# EAGLE design v003 (EAGLE 6.4)
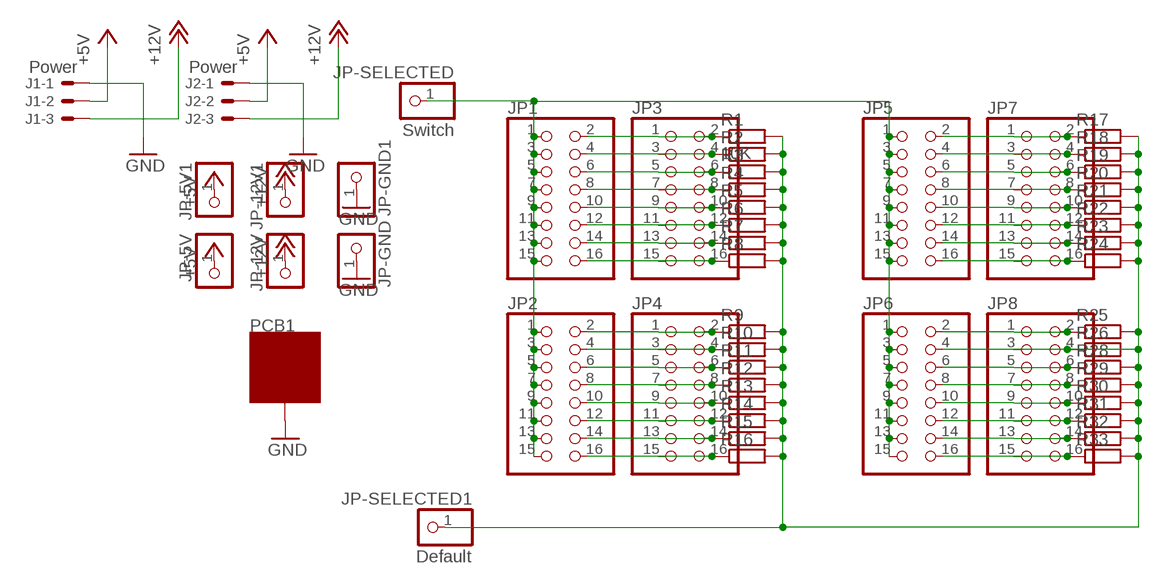
[diagram p0: schematic, sheet 1]

## Parts
J1  Power  22-27-2031-03  [6410-03]
J2  Power  22-27-2031-03  [6410-03]
JP1  PINHD-2X8  [2X08]
JP2  PINHD-2X8  [2X08]
JP3  PINHD-2X8  [2X08]
JP4  PINHD-2X8  [2X08]
JP5  PINHD-2X8  [2X08]
JP6  PINHD-2X8  [2X08]
JP7  PINHD-2X8  [2X08]
JP8  PINHD-2X8  [2X08]
JP-5V  PINHD-1X1  [1X01]
JP-5V1  PINHD-1X1  [1X01]
JP-12V  PINHD-1X1  [1X01]
JP-12V1  PINHD-1X1  [1X01]
JP-GND  PINHD-1X1  [1X01]
JP-GND1  PINHD-1X1  [1X01]
JP-SELECTED  Switch  PINHD-1X1  [1X01]
JP-SELECTED1  Default  PINHD-1X1  [1X01]
PCB1  ZZZ_MODULE05X05  [ZZZ_MODULE_05X05]
R1  10K  R-EU_0207/2V  [0207/2V]
R2  R-EU_0207/2V  [0207/2V]
R3  R-EU_0207/2V  [0207/2V]
R4  R-EU_0207/2V  [0207/2V]
R5  R-EU_0207/2V  [0207/2V]
R6  R-EU_0207/2V  [0207/2V]
R7  R-EU_0207/2V  [0207/2V]
R8  R-EU_0207/2V  [0207/2V]
R9  R-EU_0207/2V  [0207/2V]
R10  R-EU_0207/2V  [0207/2V]
R11  R-EU_0207/2V  [0207/2V]
R12  R-EU_0207/2V  [0207/2V]
R13  R-EU_0207/2V  [0207/2V]
R14  R-EU_0207/2V  [0207/2V]
R15  R-EU_0207/2V  [0207/2V]
R16  R-EU_0207/2V  [0207/2V]
R17  R-EU_0207/2V  [0207/2V]
R18  R-EU_0207/2V  [0207/2V]
R19  R-EU_0207/2V  [0207/2V]
R20  R-EU_0207/2V  [0207/2V]
R21  R-EU_0207/2V  [0207/2V]
R22  R-EU_0207/2V  [0207/2V]
R23  R-EU_0207/2V  [0207/2V]
R24  R-EU_0207/2V  [0207/2V]
R25  R-EU_0207/2V  [0207/2V]
R26  R-EU_0207/2V  [0207/2V]
R28  R-EU_0207/2V  [0207/2V]
R29  R-EU_0207/2V  [0207/2V]
R30  R-EU_0207/2V  [0207/2V]
R31  R-EU_0207/2V  [0207/2V]
R32  R-EU_0207/2V  [0207/2V]
R33  R-EU_0207/2V  [0207/2V]

## Nets
+5V: J1.2 J2.2 JP-5V1.1 JP-5V.1
+12V: J1.3 J2.3 JP-12V1.1 JP-12V.1
GND: J1.1 J2.1 JP-GND1.1 JP-GND.1 PCB1.GND@1(GND) PCB1.GND@2(GND) PCB1.GND@3(GND) PCB1.GND@4(GND) PCB1.GND@5(GND) PCB1.GND@6(GND) PCB1.GND@7(GND) PCB1.GND@8(GND)
N$1: JP1.2 JP3.1 JP3.2 R1.1
N$2: JP1.4 JP3.3 JP3.4 R2.1
N$3: JP1.6 JP3.5 JP3.6 R3.1
N$4: JP1.8 JP3.7 JP3.8 R4.1
N$5: JP1.10 JP3.9 JP3.10 R5.1
N$6: JP1.12 JP3.11 JP3.12 R6.1
N$7: JP1.14 JP3.13 JP3.14 R7.1
N$8: JP1.16 JP3.15 JP3.16 R8.1
N$9: JP2.2 JP4.1 JP4.2 R9.1
N$10: JP2.4 JP4.3 JP4.4 R10.1
N$11: JP2.6 JP4.5 JP4.6 R11.1
N$12: JP2.8 JP4.7 JP4.8 R12.1
N$13: JP2.10 JP4.9 JP4.10 R13.1
N$14: JP2.12 JP4.11 JP4.12 R14.1
N$15: JP2.14 JP4.13 JP4.14 R15.1
N$16: JP2.16 JP4.15 JP4.16 R16.1
N$18: JP5.2 JP7.1 JP7.2 R17.1
N$19: JP5.4 JP7.3 JP7.4 R18.1
N$20: JP5.6 JP7.5 JP7.6 R19.1
N$21: JP5.8 JP7.7 JP7.8 R20.1
N$22: JP5.10 JP7.9 JP7.10 R21.1
N$23: JP5.12 JP7.11 JP7.12 R22.1
N$24: JP5.14 JP7.13 JP7.14 R23.1
N$25: JP5.16 JP7.15 JP7.16 R24.1
N$26: JP6.2 JP8.1 JP8.2 R25.1
N$27: JP6.4 JP8.3 JP8.4 R26.1
N$28: JP6.6 JP8.5 JP8.6 R28.1
N$29: JP6.8 JP8.7 JP8.8 R29.1
N$30: JP6.10 JP8.9 JP8.10 R30.1
N$31: JP6.12 JP8.11 JP8.12 R31.1
N$32: JP6.14 JP8.13 JP8.14 R32.1
N$33: JP6.16 JP8.15 JP8.16 R33.1
N$34: JP1.1 JP1.3 JP1.5 JP1.7 JP1.9 JP1.11 JP1.13 JP1.15 JP2.1 JP2.3 JP2.5 JP2.7 JP2.9 JP2.11 JP2.13 JP2.15 JP5.1 JP5.3 JP5.5 JP5.7 JP5.9 JP5.11 JP5.13 JP5.15 JP6.1 JP6.3 JP6.5 JP6.7 JP6.9 JP6.11 JP6.13 JP6.15 JP-SELECTED.1
N$35: JP-SELECTED1.1 R1.2 R2.2 R3.2 R4.2 R5.2 R6.2 R7.2 R8.2 R9.2 R10.2 R11.2 R12.2 R13.2 R14.2 R15.2 R16.2 R17.2 R18.2 R19.2 R20.2 R21.2 R22.2 R23.2 R24.2 R25.2 R26.2 R28.2 R29.2 R30.2 R31.2 R32.2 R33.2

## Library data of the parts
J1 J2 = con-molex:22-?-03: CONNECTOR wire to board 2.54 mm (.1 inch) pitch header; OC_FARNELL: unknown; OC_NEWARK: unknown
JP1-JP8 = pinhead:PINHD-2X8: PIN HEADER
JP-5V JP-5V1 JP-12V JP-12V1 JP-GND JP-GND1 JP-SELECTED JP-SELECTED1 = pinhead:PINHD-1X1: PIN HEADER
PCB1 = GNLib:ZZZ_MODULE
R1-R26 R28-R33 = rcl:R-EU_: RESISTOR, European symbol

## Board
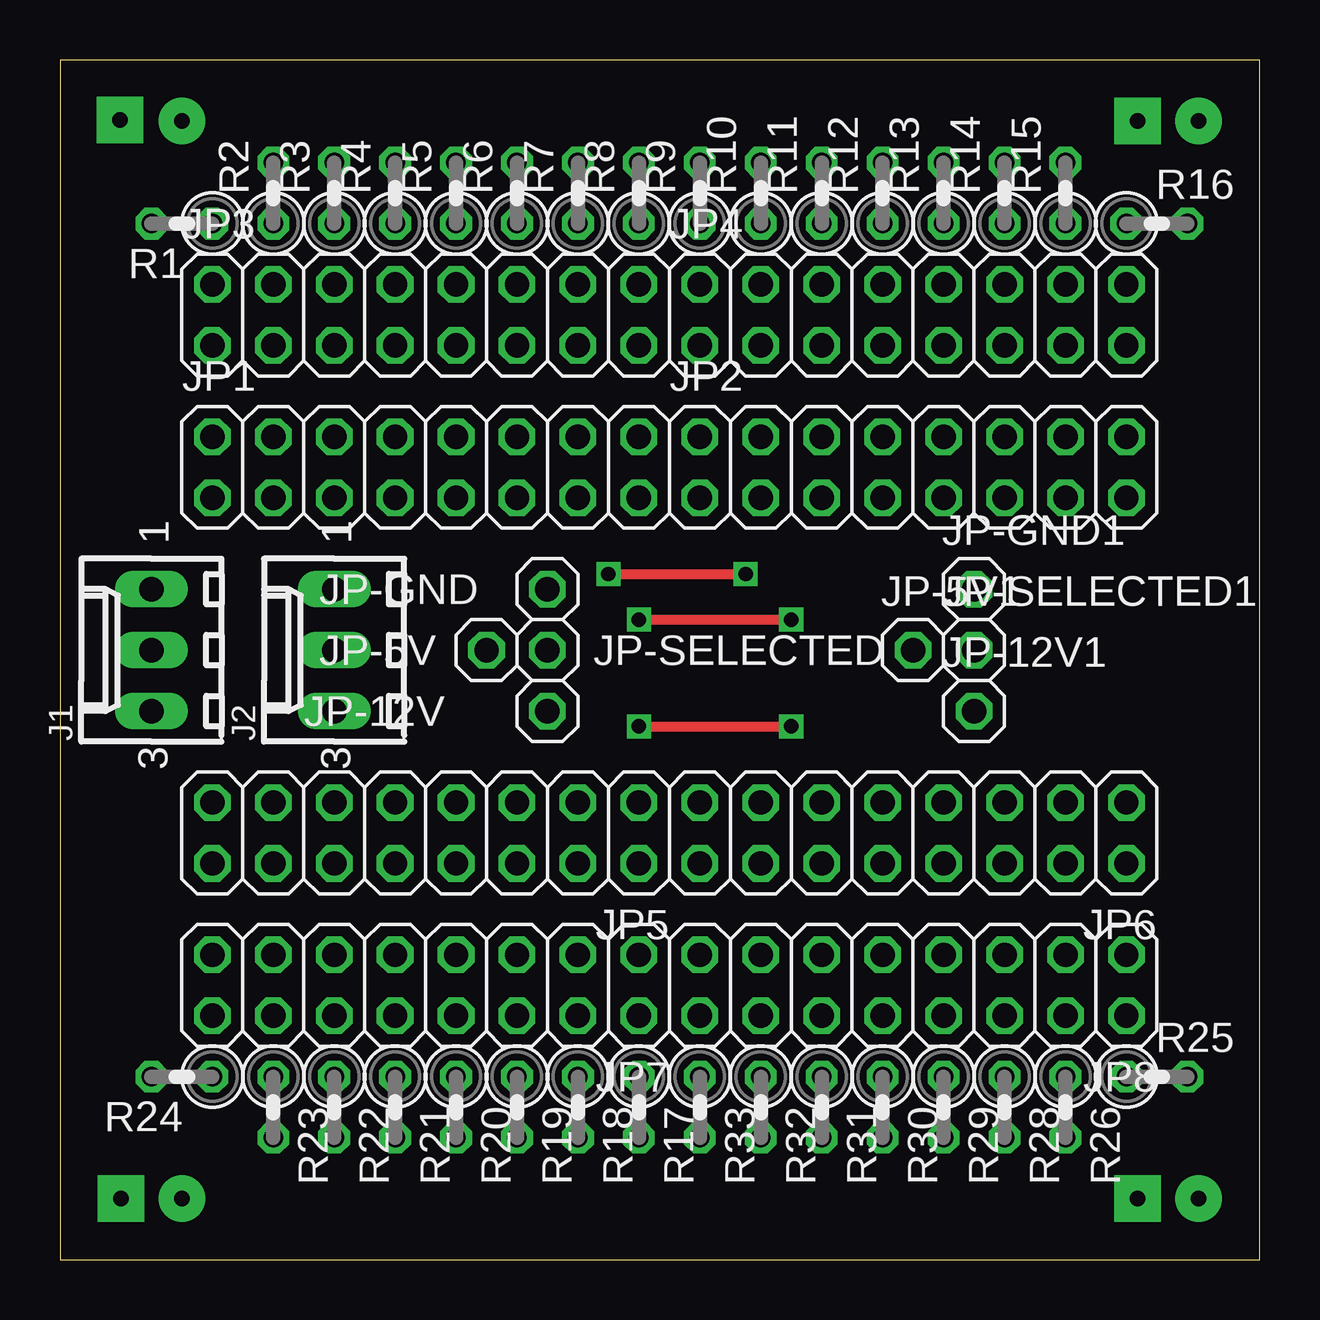
[diagram p1: board, top side]
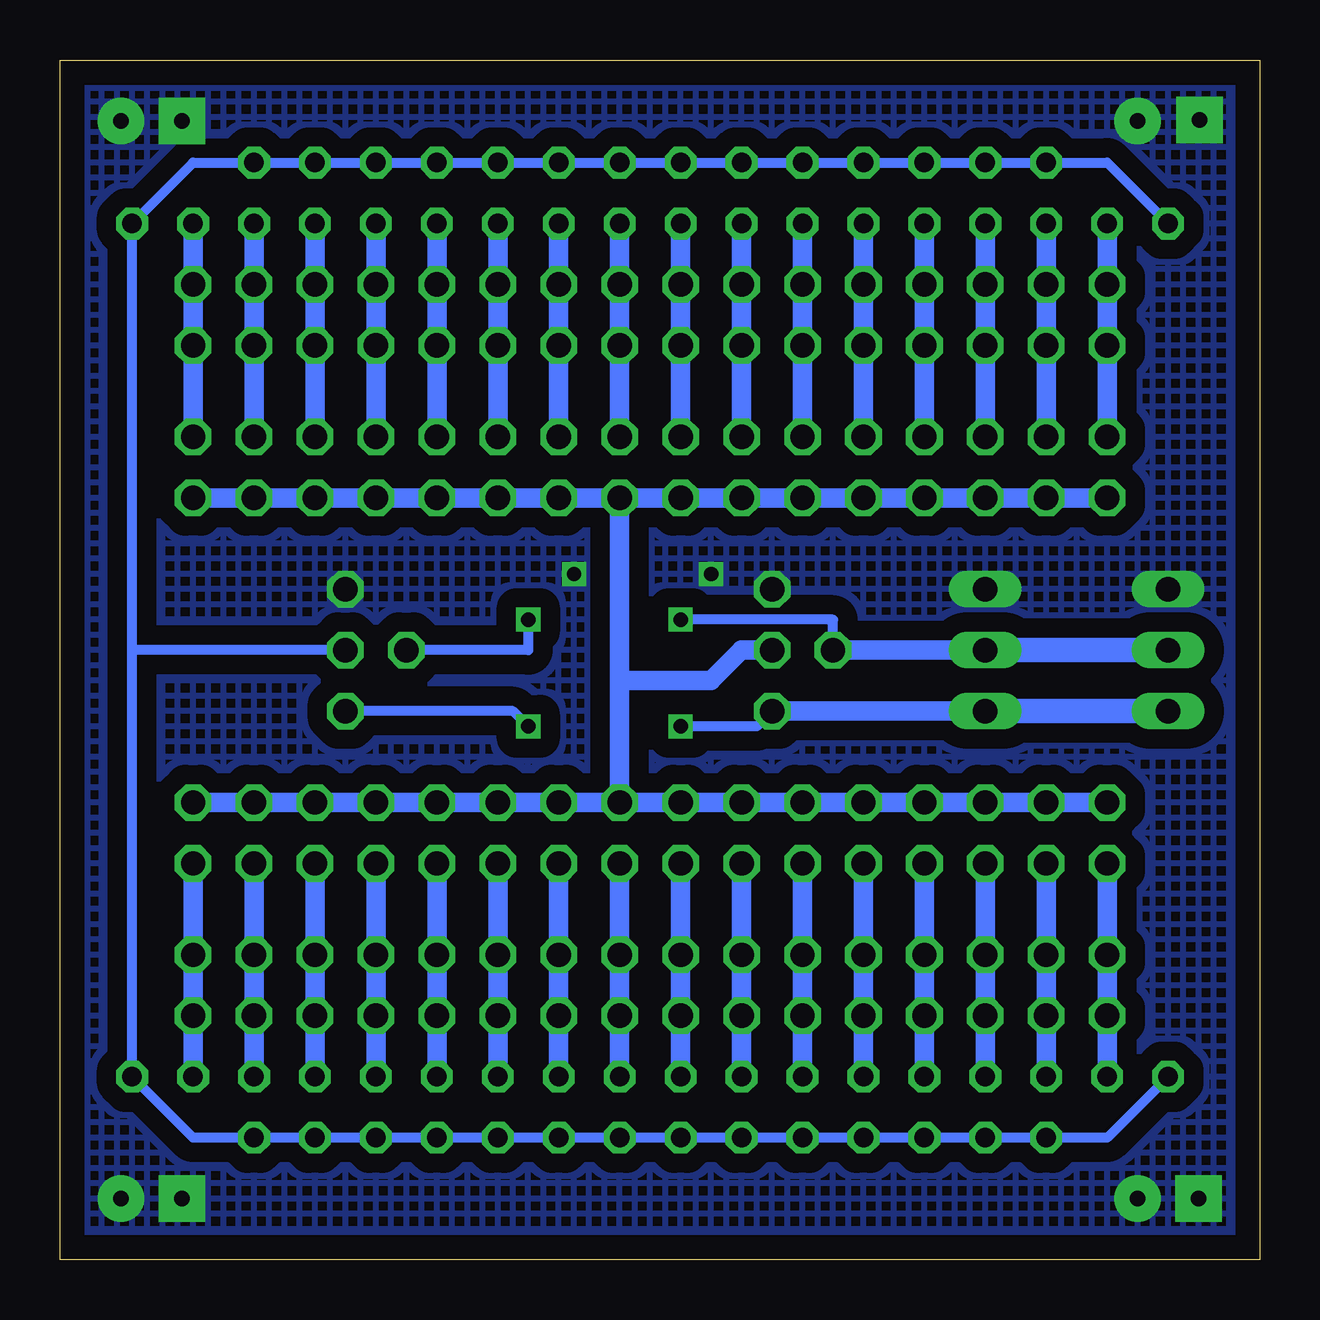
[diagram p2: board, bottom side, seen from below]

Size 50 x 50 mm. Coordinates in mm from the lower left corner, seen from the top.
Outline: 0,0 50,0 50,50 0,50 0,0
Copper layers (1*16): Top 0.035mm / dielectric 1.5mm / Bottom 0.035mm
Design rules "default": minimum track width 10mil, minimum drill 24mil, track to track 8mil, track to pad 8mil, pad to pad 8mil, via to via 8mil, smd to smd 8mil, copper to edge 40mil, drill to drill 8mil, minimum pad ring 10mil, minimum via ring 8mil, stop-mask expansion 4mil, vias tented up to drill 0mil, thermal gap 10mil

### Footprints (pad centres in the part's own frame; a part is rotated, then mirrored left to right if it is on the bottom)
6410-03 = drill 1.016 long: 1 2.54,0; 2 0,0; 3 -2.54,0
2X08 = drill 1.016 octagon: 1 -8.89,-1.27; 2 -8.89,1.27; 3 -6.35,-1.27; 4 -6.35,1.27; 5 -3.81,-1.27; 6 -3.81,1.27; 7 -1.27,-1.27; 8 -1.27,1.27; 9 1.27,-1.27; 10 1.27,1.27; 11 3.81,-1.27; 12 3.81,1.27; 13 6.35,-1.27; 14 6.35,1.27; 15 8.89,-1.27; 16 8.89,1.27
1X01 = drill 1.016 octagon: 1 0,0
ZZZ_MODULE_05X05 = drill 0.64 pad 1.93 square: GND@1 2.5,47.5; GND@2 44.92,47.46; GND@7 2.54,2.54; GND@8 44.92,2.54 | drill 0.64 pad 1.93: GND@3 47.46,47.46; GND@4 5.08,47.46; GND@5 47.46,2.54; GND@6 5.08,2.54
0207/2V = drill 0.813 octagon: 1 -1.27,0; 2 1.27,0

### Placement (x,y rotation side)
J1  3.81,25.4 90 top
J2  11.43,25.4 90 top
JP1  15.24,33.02 0 top
JP2  35.56,33.02 0 top
JP3  15.24,39.37 0 top
JP4  35.56,39.37 0 top
JP5  15.24,17.78 180 top
JP6  35.56,17.78 180 top
JP7  15.24,11.43 180 top
JP8  35.56,11.43 180 top
JP-5V  17.78,25.4 0 top
JP-5V1  35.56,25.4 0 top
JP-12V  20.32,22.86 0 top
JP-12V1  38.1,22.86 0 top
JP-GND  20.32,27.94 0 top
JP-GND1  38.1,27.94 0 top
JP-SELECTED  20.32,25.4 0 top
JP-SELECTED1  38.1,25.4 0 top
PCB1  0,0 0 top
R1  5.08,43.18 180 top
R2  8.89,44.45 90 top
R3  11.43,44.45 90 top
R4  13.97,44.45 90 top
R5  16.51,44.45 90 top
R6  19.05,44.45 90 top
R7  21.59,44.45 90 top
R8  24.13,44.45 90 top
R9  26.67,44.45 90 top
R10  29.21,44.45 90 top
R11  31.75,44.45 90 top
R12  34.29,44.45 90 top
R13  36.83,44.45 90 top
R14  39.37,44.45 90 top
R15  41.91,44.45 90 top
R16  45.72,43.18 0 top
R17  24.13,6.35 270 top
R18  21.59,6.35 270 top
R19  19.05,6.35 270 top
R20  16.51,6.35 270 top
R21  13.97,6.35 270 top
R22  11.43,6.35 270 top
R23  8.89,6.35 270 top
R24  5.08,7.62 180 top
R25  45.72,7.62 0 top
R26  41.91,6.35 270 top
R28  39.37,6.35 270 top
R29  36.83,6.35 270 top
R30  34.29,6.35 270 top
R31  31.75,6.35 270 top
R32  29.21,6.35 270 top
R33  26.67,6.35 270 top

### Tracks (layer width: path | path; a pad name or v marks a point on that pad's centre or on a via)
+5V  (via drill 0.6)
  Top 0.406: v24.13,26.67 v30.48,26.67
  Bottom 0.406: v30.48,26.67 30.48,25.4 JP-5V1.1 | JP-5V.1 17.78,26.67 v24.13,26.67
  Bottom 0.813: J2.2 JP-5V.1
  Bottom 1.016: J1.2 J2.2
+12V  (via drill 0.6)
  Top 0.406: v24.13,22.23 v30.48,22.23
  Bottom 0.406: JP-12V.1 20.95,22.23 v24.13,22.23 | v30.48,22.23 31.11,22.86 JP-12V1.1
  Bottom 0.813: J2.3 JP-12V.1
  Bottom 1.016: J2.3 J1.3
GND  (via drill 0.6)
  Top 0.406: v22.86,28.57 v28.57,28.57
  pour Bottom (isolate 0.813, no thermals, hatched): 0,0 50,0 50,50 0,50
N$1
  Bottom 0.813: JP1.2 JP3.1 JP3.2 R1.1
N$2
  Bottom 0.813: R2.1 JP3.4 JP3.3 JP1.4
N$3
  Bottom 0.813: JP1.6 JP3.5 JP3.6 R3.1
N$4
  Bottom 0.813: R4.1 JP3.8 JP3.7 JP1.8
N$5
  Bottom 0.813: JP1.10 JP3.9 JP3.10 R5.1
N$6
  Bottom 0.813: R6.1 JP3.12 JP3.11 JP1.12
N$7
  Bottom 0.813: JP1.14 JP3.13 JP3.14 R7.1
N$8
  Bottom 0.813: R8.1 JP3.16 JP3.15 JP1.16
N$9
  Bottom 0.813: JP2.2 JP4.1 JP4.2 R9.1
N$10
  Bottom 0.813: R10.1 JP4.4 JP4.3 JP2.4
N$11
  Bottom 0.813: JP2.6 JP4.5 JP4.6 R11.1
N$12
  Bottom 0.813: R12.1 JP4.8 JP4.7 JP2.8
N$13
  Bottom 0.813: JP2.10 JP4.9 JP4.10 R13.1
N$14
  Bottom 0.813: R14.1 JP4.12 JP4.11 JP2.12
N$15
  Bottom 0.813: JP2.14 JP4.13 JP4.14 R15.1
N$16
  Bottom 0.813: R16.1 JP4.16 JP4.15 JP2.16
N$18
  Bottom 0.813: R17.1 JP7.2 JP7.1 JP5.2
N$19
  Bottom 0.813: R18.1 JP7.4 JP7.3 JP5.4
N$20
  Bottom 0.813: R19.1 JP7.6 JP7.5 JP5.6
N$21
  Bottom 0.813: R20.1 JP7.8 JP7.7 JP5.8
N$22
  Bottom 0.813: JP5.10 JP7.9 JP7.10 R21.1
N$23
  Bottom 0.813: R22.1 JP7.12 JP7.11 JP5.12
N$24
  Bottom 0.813: JP5.14 JP7.13 JP7.14 R23.1
N$25
  Bottom 0.813: R24.1 JP7.16 JP7.15 JP5.16
N$26
  Bottom 0.813: JP6.2 JP8.1 JP8.2 R25.1
N$27
  Bottom 0.813: R26.1 JP8.4 JP8.3 JP6.4
N$28
  Bottom 0.813: JP6.6 JP8.5 JP8.6 R28.1
N$29
  Bottom 0.813: JP6.8 JP8.7 JP8.8 R29.1
N$30
  Bottom 0.813: R30.1 JP8.10 JP8.9 JP6.10
N$31
  Bottom 0.813: JP6.12 JP8.11 JP8.12 R31.1
N$32
  Bottom 0.813: R32.1 JP8.14 JP8.13 JP6.14
N$33
  Bottom 0.813: JP6.16 JP8.15 JP8.16 R33.1
N$34
  Bottom 0.813: JP2.1 26.67,24.13 | 26.67,24.13 JP6.15 | JP1.1 JP1.3 JP1.5 JP1.7 JP1.9 JP1.11 JP1.13 JP1.15 JP2.1 | JP2.1 JP2.3 JP2.5 JP2.7 JP2.9 JP2.11 JP2.13 JP2.15 | JP-SELECTED.1 21.59,25.4 22.86,24.13 26.67,24.13 | JP5.15 JP5.13 JP5.11 JP5.9 JP5.7 JP5.5 JP5.3 JP5.1 JP6.15 | JP6.15 JP6.13 JP6.11 JP6.9 JP6.7 JP6.5 JP6.3 JP6.1
N$35
  Bottom 0.406: JP-SELECTED1.1 46.99,25.4 | 46.99,25.4 R16.2 44.45,45.72 R15.2 R14.2 R13.2 R12.2 R11.2 R10.2 R9.2 R8.2 R7.2 R6.2 R5.2 R4.2 R3.2 R2.2 6.35,45.72 R1.2 | R24.2 6.35,5.08 R23.2 R22.2 R21.2 R20.2 R19.2 R18.2 R17.2 R33.2 R32.2 R31.2 R30.2 R29.2 R28.2 R26.2 44.45,5.08 R25.2 46.99,25.4